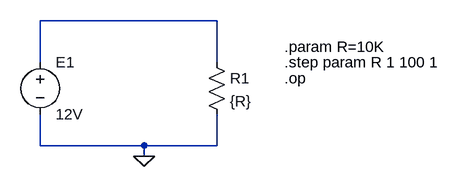
[diagram p0: schematic validation_loi_ohm.asc]
validation_loi_ohm.asc, the LTspice schematic file:
Version 4
SHEET 1 1036 680
WIRE 352 32 80 32
WIRE 80 96 80 32
WIRE 352 96 352 32
WIRE 80 224 80 176
WIRE 240 224 80 224
WIRE 352 224 352 176
WIRE 352 224 240 224
WIRE 240 240 240 224
FLAG 240 240 0
SYMBOL res 336 80 R0
SYMATTR InstName R1
SYMATTR Value {R}
SYMBOL voltage 80 80 R0
WINDOW 123 0 0 Left 0
WINDOW 39 0 0 Left 0
SYMATTR InstName E1
SYMATTR Value 12V
TEXT 456 72 Left 2 !.param R=10K
TEXT 456 96 Left 2 !.step param R 1 100 1
TEXT 456 120 Left 2 !.op

The netlist it stands for:
* validation_loi_ohm.asc
R1 N001 0 {R}
V§E1 N001 0 12V
.param R=10K
.step param R 1 100 1
.op
.backanno
.end

* Results of the author's LTspice run, read from the files saved beside the schematic
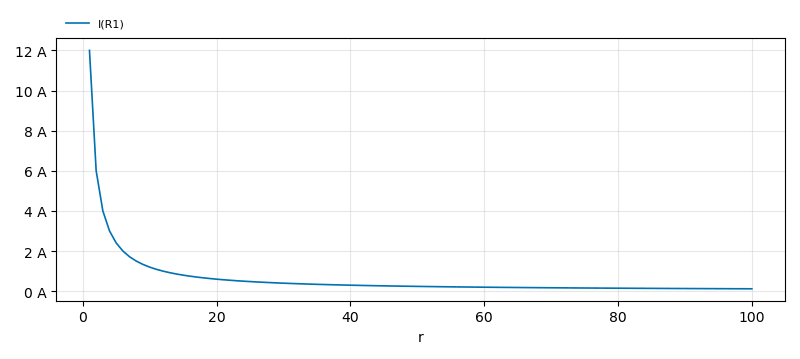
[diagram p1: Operating Point of validation_loi_ohm.asc, plotted from the saved traces]
* Operating Point, 1 run:
*   I(R1): 12 A at r=1 , 120 mA at r=100 , min 120 mA, max 12 A